# EAGLE design IO_wing (EAGLE 6.4)
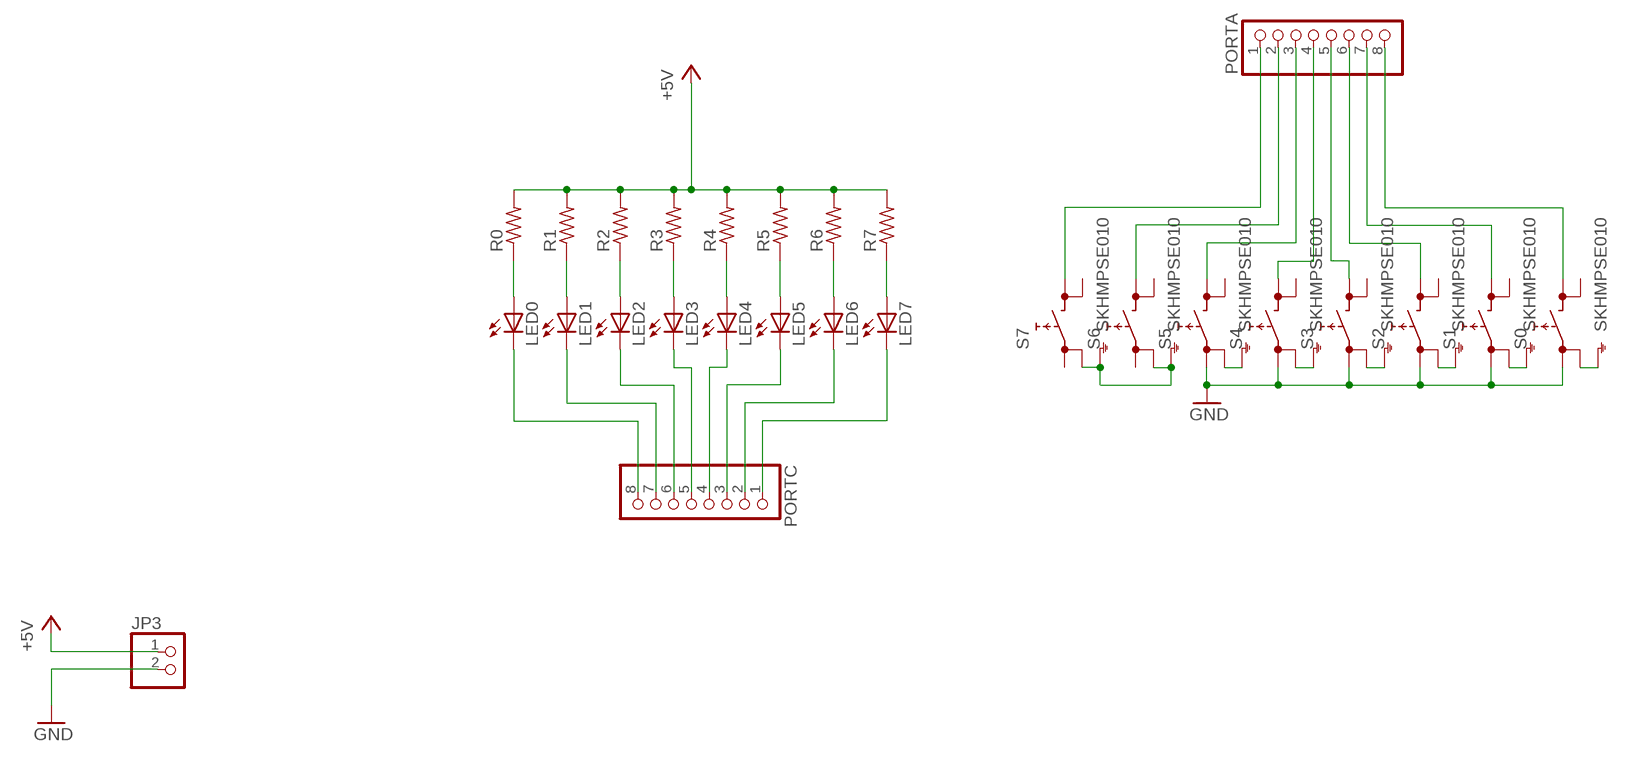
[diagram p0: schematic, sheet 1]

## Parts
JP3  PINHD-1X2  [1X02]
LED0  LEDCHIP-LED0805  [CHIP-LED0805]
LED1  LEDCHIP-LED0805  [CHIP-LED0805]
LED2  LEDCHIP-LED0805  [CHIP-LED0805]
LED3  LEDCHIP-LED0805  [CHIP-LED0805]
LED4  LEDCHIP-LED0805  [CHIP-LED0805]
LED5  LEDCHIP-LED0805  [CHIP-LED0805]
LED6  LEDCHIP-LED0805  [CHIP-LED0805]
LED7  LEDCHIP-LED0805  [CHIP-LED0805]
PORTA  PINHD-1X8  [1X08]
PORTC  PINHD-1X8  [1X08]
R0  R-US_R0805  [R0805]
R1  R-US_R0805  [R0805]
R2  R-US_R0805  [R0805]
R3  R-US_R0805  [R0805]
R4  R-US_R0805  [R0805]
R5  R-US_R0805  [R0805]
R6  R-US_R0805  [R0805]
R7  R-US_R0805  [R0805]
S0  SKHMPSE010  [SKHMPXE010]
S1  SKHMPSE010  [SKHMPXE010]
S2  SKHMPSE010  [SKHMPXE010]
S3  SKHMPSE010  [SKHMPXE010]
S4  SKHMPSE010  [SKHMPXE010]
S5  SKHMPSE010  [SKHMPXE010]
S6  SKHMPSE010  [SKHMPXE010]
S7  SKHMPSE010  [SKHMPXE010]

## Nets
+5V: JP3.1 R0.2 R1.2 R2.2 R3.2 R4.2 R5.2 R6.2 R7.2
GND: JP3.2 S0.1(1.1) S1.1(1.1) S2.1(1.1) S3.1(1.1) S4.1(1.1) S5.1(1.1)
N$1: PORTA.4 S4.3(2.1)
N$2: PORTA.5 S3.3(2.1)
N$3: LED0.A R0.1
N$4: LED1.A R1.1
N$5: LED2.A R2.1
N$6: LED3.A R3.1
N$7: LED4.A R4.1
N$8: LED5.A R5.1
N$9: LED6.A R6.1
N$10: LED7.A R7.1
N$11: LED2.C PORTC.6
N$12: LED3.C PORTC.5
N$13: LED4.C PORTC.4
N$14: LED1.C PORTC.7
N$15: LED0.C PORTC.8
N$16: LED5.C PORTC.3
N$17: LED6.C PORTC.2
N$18: LED7.C PORTC.1
N$19: PORTA.3 S5.3(2.1)
N$20: PORTA.2 S6.3(2.1)
N$21: PORTA.1 S7.3(2.1)
N$22: PORTA.6 S2.3(2.1)
N$23: PORTA.7 S1.3(2.1)
N$24: PORTA.8 S0.3(2.1)
N$25: S6.2(1.2) S6.5(SH) S7.2(1.2) S7.5(SH)
N$27: S5.2(1.2) S5.5(SH)
N$28: S1.2(1.2) S1.5(SH)
N$29: S3.2(1.2) S3.5(SH)
N$30: S2.2(1.2) S2.5(SH)
N$31: S0.2(1.2) S0.5(SH)
N$32: S4.2(1.2) S4.5(SH)
Unconnected: S0.4(2.2) S1.4(2.2) S2.4(2.2) S3.4(2.2) S4.4(2.2) S5.4(2.2) S6.1(1.1) S6.4(2.2) S7.1(1.1) S7.4(2.2)

## Library data of the parts
JP3 = pinhead:PINHD-1X2: PIN HEADER
LED0 LED1-LED7 = led:LED: LED OSRAM: - CHIPLED LG R971, LG N971, LY N971, LG Q971, LY Q971, LO R971, LY R971 LH N974, LH R974 LS Q976, LO Q976, LY Q976 LO Q996 - Hyper CHIPLED LW Q18S LB Q993, LB Q99A, LB R99A - SideLED LS A670, LO A670, LY A670, LG A670, LP A670 LB A673, LV A673, LT A673, LW A673 LH A674 LY A675 LS A676, LA A676, LO A676, LY A676, LW A676 LS A679, LY A679, LG A679 - Hyper Micro SIDELED® LS Y876, LA Y876, LO Y876, LY Y876 LT Y87S - SmartLED LW L88C, LW L88S LB L89C, LB L89S, LG L890 LS L89K, LO L89K, LY L89K LS L896, LA L896, LO L896, LY L896 - TOPLED LS T670, LO T670, LY T670, LG T670, LP T670 LSG T670, LSP T670, LSY T670, LOP T670, LYG T670 LG T671, LOG T671, LSG T671 LB T673, LV T673, LT T673, LW T673 LH T674 LS T676, LA T676, LO T676, LY T676, LB T676, LH T676, LSB T676, LW T676 LB T67C, LV T67C, LT T67C, LS T67K, LO T67K, LY T67K, LW E67C LS E67B, LA E67B, LO E67B, LY E67B, LB E67C, LV E67C, LT E67C LW T67C LS T679, LY T679, LG T679 LS T770, LO T770, LY T770, LG T770, LP T770 LB T773, LV T773, LT T773, LW T773 LH T774 LS E675, LA E675, LY E675, LS T675 LS T776, LA T776, LO T776, LY T776, LB T776 LHGB T686 LT T68C, LB T68C - Hyper Mini TOPLED® LB M676 - Mini TOPLED Santana® LG M470 LS M47K, LO M47K, LY M47K Source: http://www.osram.convergy.de LUXEON: - LUMILED® LXK2-PW12-R00, LXK2-PW12-S00, LXK2-PW14-U00, LXK2-PW14-V00 LXK2-PM12-R00, LXK2-PM12-S00, LXK2-PM14-U00 LXK2-PE12-Q00, LXK2-PE12-R00, LXK2-PE12-S00, LXK2-PE14-T00, LXK2-PE14-U00 LXK2-PB12-K00, LXK2-PB12-L00, LXK2-PB12-M00, LXK2-PB14-N00, LXK2-PB14-P00, LXK2-PB14-Q00 LXK2-PR12-L00, LXK2-PR12-M00, LXK2-PR14-Q00, LXK2-PR14-R00 LXK2-PD12-Q00, LXK2-PD12-R00, LXK2-PD12-S00 LXK2-PH12-R00, LXK2-PH12-S00 LXK2-PL12-P00, LXK2-PL12-Q00, LXK2-PL12-R00 Source: www.luxeon.com KINGBRIGHT: KA-3528ASYC Source: www.kingbright.com
PORTA PORTC = pinhead:PINHD-1X8: PIN HEADER
R0 R1-R7 = resistor:R-US_: RESISTOR, American symbol
S0 S1-S7 = switch:SKHMP*E010: 6.2 X 6.5mm TACT Switch (SMD) Source: http://www3.alps.co.jp/WebObjects/catalog.woa/PDF/E/Switch/Tact/SKHM/SKHM.PDF

## Board
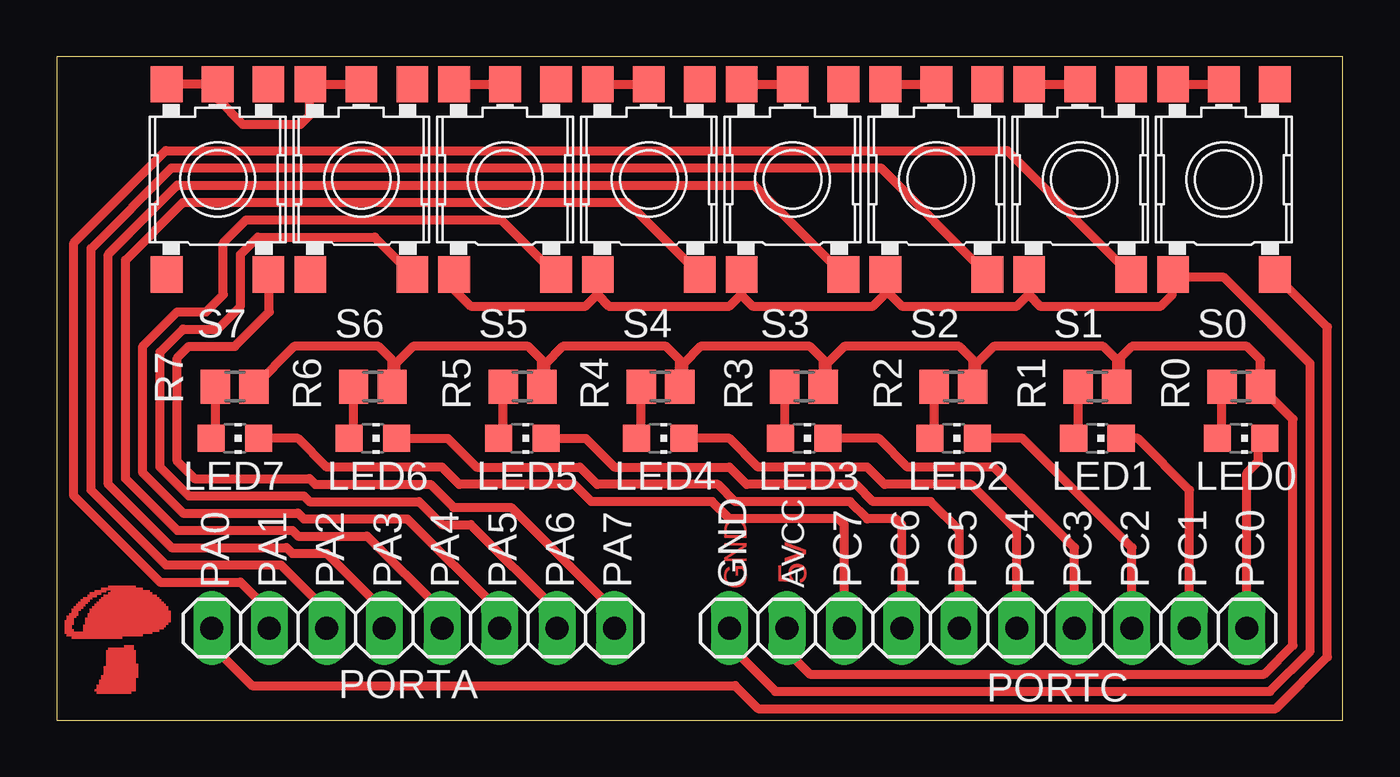
[diagram p1: board, top side]

Size 56.82 x 29.3 mm. Coordinates in mm from the lower left corner, seen from the top.
Outline: 0,0 56.82,0 56.82,29.3 0,29.3 0,0
Copper layers (1*16): Top 0.035mm / dielectric 1.5mm / Bottom 0.035mm
Design rules "SparkFun": minimum track width 8mil, minimum drill 20mil, track to track 8mil, track to pad 8mil, pad to pad 8mil, via to via 8mil, smd to smd 8mil, copper to edge 10mil, drill to drill 8mil, minimum pad ring 12mil, minimum via ring 10mil, stop-mask expansion 4mil, vias tented up to drill 25mil, thermal gap 10mil

### Footprints (pad centres in the part's own frame; a part is rotated, then mirrored left to right if it is on the bottom)
1X02 = drill 1.016 long: 1 -1.27,0; 2 1.27,0
CHIP-LED0805 = smd 1.2 x 1.2: A 0,-1.05; C 0,1.05
1X08 = drill 1.016 long: 1 -8.89,0; 2 -6.35,0; 3 -3.81,0; 4 -1.27,0; 5 1.27,0; 6 3.81,0; 7 6.35,0; 8 8.89,0
R0805 = smd 1.3 x 1.5: 1 -0.85,0; 2 0.85,0
SKHMPXE010 = smd 1.6 x 1.4: 1 -4.2,2.25; 2 4.2,2.25; 3 -4.2,-2.25; 4 4.2,-2.25; 5 4.2,0

### Placement (x,y rotation side)
JP3  30.99,4.06 180 top
LED0  52.32,12.45 270 top
LED1  45.97,12.45 270 top
LED2  39.62,12.45 270 top
LED3  33.02,12.45 270 top
LED4  26.67,12.45 270 top
LED5  20.57,12.45 270 top
LED6  13.97,12.45 270 top
LED7  7.87,12.45 270 top
PORTA  15.75,4.06 180 top
PORTC  43.69,4.06 0 top
R0  52.32,14.73 0 top
R1  45.97,14.73 0 top
R2  39.62,14.73 0 top
R3  33.02,14.73 0 top
R4  26.67,14.73 0 top
R5  20.57,14.73 0 top
R6  13.97,14.73 0 top
R7  7.87,14.73 0 top
S0  51.56,23.88 90 top
S1  45.21,23.88 90 top
S2  38.86,23.88 90 top
S3  32.51,23.88 90 top
S4  26.16,23.88 90 top
S5  19.81,23.88 90 top
S6  13.46,23.88 90 top
S7  7.11,23.88 90 top

### Tracks (layer width: path | path; a pad name or v marks a point on that pad's centre or on a via)
+5V
  Top 0.406: JP3.1 32.26,3.05 33.27,2.03 53.34,2.03 54.61,3.3 54.61,13.3 R0.2 53.17,15.91 52.58,16.51 47.5,16.51 46.99,16 46.99,14.9 R1.2 46.82,15.91 46.23,16.51 41.4,16.51 40.64,15.75 40.64,14.9 R2.2 40.47,15.91 39.88,16.51 34.8,16.51 34.04,15.75 34.04,14.9 R3.2 33.87,15.91 33.27,16.51 28.45,16.51 27.69,15.75 27.69,14.9 R4.2 27.52,15.91 26.92,16.51 22.35,16.51 21.59,15.75 21.59,14.9 R5.2 21.42,15.91 20.83,16.51 15.75,16.51 14.99,15.75 14.99,14.9 R6.2 14.82,15.91 14.22,16.51 10.5,16.51 R7.2
GND
  Top 0.406: S5.1 17.56,19.01 18.29,18.29 23.37,18.29 23.88,18.8 23.88,19.64 S4.1 23.91,18.76 24.38,18.29 29.72,18.29 30.23,18.8 30.23,19.64 S3.1 30.26,18.76 30.73,18.29 36.07,18.29 36.58,18.8 36.58,19.64 S2.1 36.61,19.01 37.34,18.29 42.42,18.29 42.93,18.8 42.93,19.64 S1.1 42.96,18.76 43.43,18.29 48.77,18.29 49.28,18.8 49.28,19.64 S0.1 49.43,19.56 51.56,19.56 55.37,15.75 55.37,3.05 53.59,1.27 31.75,1.27 29.72,3.3 JP3.2
N$1
  Top 0.406: S4.3 25.23,22.86 5.59,22.86 3.05,20.32 3.05,10.67 5.33,8.38 10.41,8.38 10.67,8.13 13.72,8.13 17.02,4.83 PORTA.4
N$2
  Top 0.406: S3.3 30.82,23.62 5.33,23.62 2.29,20.57 2.29,10.41 5.08,7.62 10.16,7.62 10.41,7.37 11.94,7.37 14.48,4.83 PORTA.5
N$3
  Top 0.406: LED0.A 51.47,12.65 R0.1
N$4
  Top 0.406: LED1.A 45.12,12.65 R1.1
N$5
  Top 0.406: LED2.A 38.77,12.65 R2.1
N$6
  Top 0.406: LED3.A 32.17,12.65 R3.1
N$7
  Top 0.406: LED4.A 25.82,12.65 R4.1
N$8
  Top 0.406: LED5.A 19.72,12.9 R5.1
N$9
  Top 0.406: LED6.A 13.12,12.65 R6.1
N$10
  Top 0.406: LED7.A 7.02,12.65 R7.1
N$11
  Top 0.406: PORTC.6 47.5,7.62 42.67,12.45 LED2.C
N$12
  Top 0.406: PORTC.5 44.96,7.62 41.4,11.18 37.59,11.18 36.32,12.45 LED3.C
N$13
  Top 0.406: PORTC.4 42.42,8.38 40.39,10.41 36.58,10.41 35.81,11.18 30.99,11.18 29.72,12.45 LED4.C
N$14
  Top 0.406: PORTC.7 50.04,10.16 47.75,12.45 LED1.C
N$15
  Top 0.406: 53.34,12.41 LED0.C 53.09,12.16 53.09,11.43 52.58,10.92 PORTC.8
N$16
  Top 0.406: LED5.C 23.37,12.45 24.64,11.18 29.72,11.18 30.48,10.41 35.31,10.41 36.07,9.65 38.61,9.65 39.88,8.38 PORTC.3
N$17
  Top 0.406: LED6.C 17.27,12.45 18.54,11.18 23.11,11.18 23.88,10.41 29.21,10.41 29.97,9.65 35.05,9.65 35.81,8.89 37.08,8.89 37.34,8.64 PORTC.2
N$18
  Top 0.406: PORTC.1 34.8,8.64 34.54,8.89 29.72,8.89 28.96,9.65 23.62,9.65 22.86,10.41 17.78,10.41 17.02,11.18 11.94,11.18 10.67,12.45 LED7.C
N$19
  Top 0.406: S5.3 19.64,22.1 8.38,22.1 7.37,21.08 7.37,18.8 6.6,18.03 5.33,18.03 3.81,16.51 3.81,10.92 5.59,9.14 10.67,9.14 10.92,8.89 15.49,8.89 19.56,4.83 PORTA.3
N$20
  Top 0.406: S6.3 14.05,21.34 8.89,21.34 8.13,20.57 8.13,18.29 7.11,17.27 5.59,17.27 4.57,16.26 4.57,11.18 5.84,9.91 10.92,9.91 11.18,9.65 16,9.65 17.02,8.64 18.29,8.64 22.1,4.83 PORTA.2
N$21
  Top 0.406: S7.3 9.4,19.64 9.4,18.03 7.87,16.51 5.84,16.51 5.33,16 5.33,11.43 6.1,10.67 11.18,10.67 11.43,10.41 16.51,10.41 17.53,9.4 20.07,9.4 24.64,4.83 PORTA.1
N$22
  Top 0.406: S2.3 36.4,24.38 5.08,24.38 1.52,20.83 1.52,10.16 4.83,6.86 9.91,6.86 11.94,4.83 PORTA.6
N$23
  Top 0.406: S1.3 41.99,25.15 4.83,25.15 0.76,21.08 0.76,9.91 4.57,6.1 8.13,6.1 9.4,4.83 PORTA.7
N$24
  Top 0.406: PORTA.8 6.86,3.3 8.64,1.52 29.97,1.52 30.99,0.51 53.85,0.51 56.13,2.79 56.13,17.35 S0.3
N$25
  Top 0.406: S7.2 S7.5 7.11,27.43 8.23,26.31 10.77,26.31 11.18,26.72 11.18,28.04 S6.2 | 11.21,28.67 S6.2 | S6.2 S6.5
N$27
  Top 0.406: S5.2 S5.5
N$28
  Top 0.406: S1.2 S1.5 45.21,28.19
N$29
  Top 0.406: S3.2 S3.5
N$30
  Top 0.406: S2.2 S2.5
N$31
  Top 0.406: S0.2 S0.5
N$32
  Top 0.406: S4.2 S4.5
(copper drawn outside any net)
  shapes: Top area x62

### Text on the board
Top: GND | 5v
tNames: PA0 | PA1 | PA2 | PA3 | PA4 | PA5 | PA6 | PA7 | GND | AVCC | PC7 | PC6 | PC5 | PC4 | PC3 | PC2 | PC1 | PC0